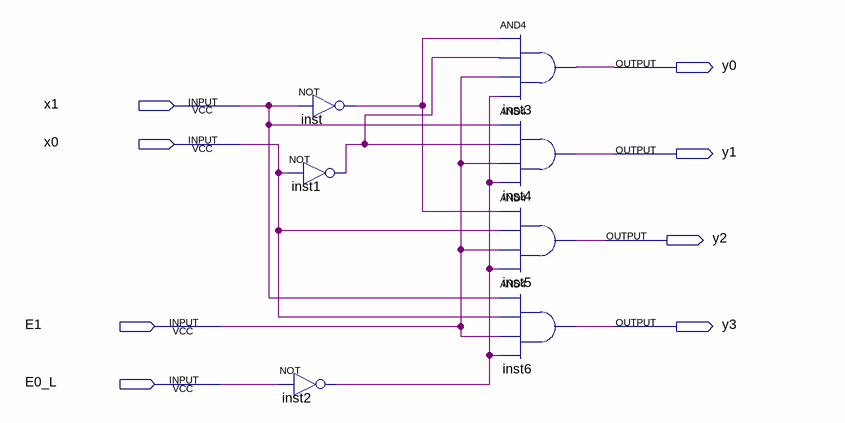
[diagram p0: schematic sheet]
// Quartus schematic Dec2_4.bdf as structural Verilog: 7 symbols, 8 pins
module Dec2_4 (
  input  x1,
  input  x0,
  input  E1,
  input  E0_L,
  output y0,
  output y1,
  output y2,
  output y3
);

  wire inst1_out, inst2_out, inst_out;

  not inst (inst_out, x1);
  not inst1 (inst1_out, x0);
  not inst2 (inst2_out, E0_L);
  and inst3 (y0, inst_out, inst1_out, E1, inst2_out);
  and inst4 (y1, x1, inst1_out, E1, inst2_out);
  and inst5 (y2, inst_out, x0, E1, inst2_out);
  and inst6 (y3, x1, x0, E1, inst2_out);
endmodule
